# Altium schematic sheet BEE_BOARD_BLOCK_DIAG.SchDoc
size Tabloid; DocumentNumber: 2; SheetNumber: 2; SheetTotal: 7; Sheet_Name: Insert name in Document Parameters; Size: 11x17
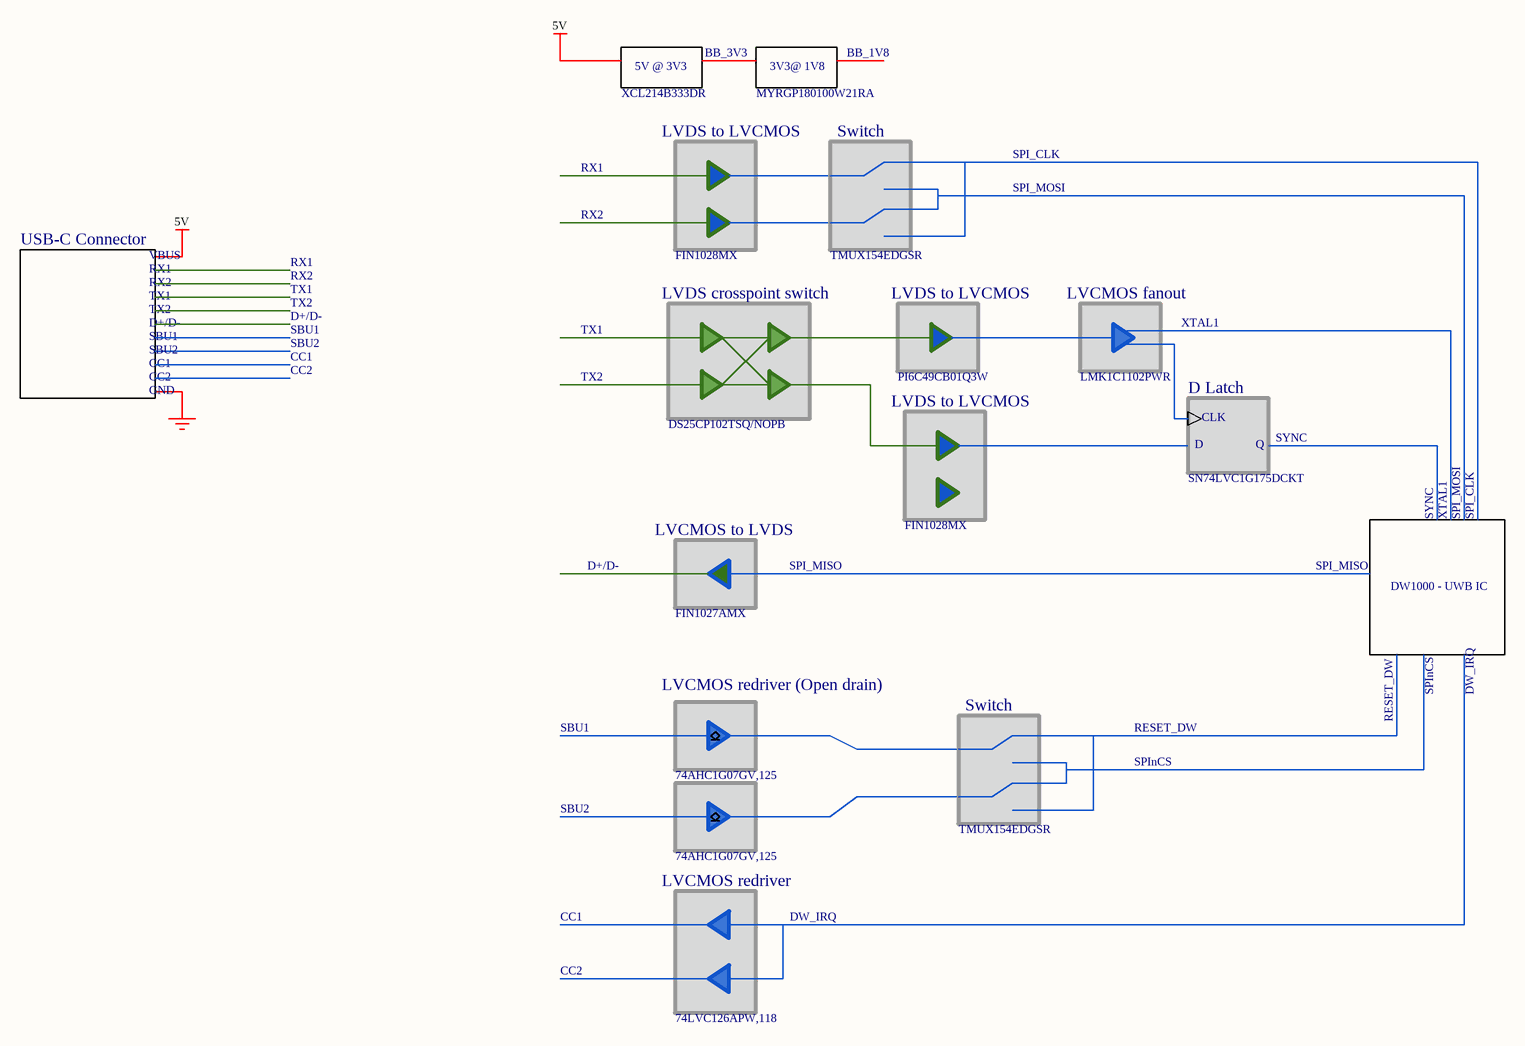
[diagram p0: BEE_BOARD_BLOCK_DIAG.SchDoc]

## Notes on the sheet
- 5V
- 5V @ 3V3
- BB_3V3
- 3V3@ 1V8
- BB_1V8
- XCL214B333DR
- LVDS to LVCMOS
- MYRGP180100W21RA
- Switch
- RX1
- SPI_CLK
- SPI_MOSI
- USB-C Connector
- VBUS
- RX2
- FIN1028MX
- TMUX154EDGSR
- TX1
- TX2
- D+/D-
- SBU1
- LVDS crosspoint switch
- LVCMOS fanout
- XTAL1
- CC1
- CC2
- SBU2
- GND
- PI6C49CB01Q3W
- LMK1C1102PWR
- D Latch
- DS25CP102TSQ/NOPB
- D
- CLK
- Q
- SYNC
- LVCMOS to LVDS
- SN74LVC1G175DCKT
- SPI_MISO
- DW1000 - UWB IC
- FIN1027AMX
- LVCMOS redriver (Open drain)
- RESET_DW
- SPInCS
- DW_IRQ
- 74AHC1G07GV,125
- LVCMOS redriver
- 74LVC126APW,118
- Sheet Name
- Project Title
- Global Project
- Size
- Group
- Revision
- Date
- Sheet
- of
- Filename
- Designers